# Altium schematic sheet 01_USB.SchDoc: =GlobalProjectName
size 594 x 420 mm; CheckedBy: A_D; Author: A_D; SheetNumber: 1; SheetTotal: 3; PageSetup: Record=PageOptions|CenterHorizontal=True|CenterVertical=True|PrintScale=0.70|XCorrection=1.00|YCorrection=1.00|PrintKind=2|BorderSize=5000000|LeftOffset=9000|BottomOffset=10100|Orientation=2|PaperLength=11176|PaperWidth=8636|Scale=100|PaperSource=259|PrintQuality=-3|MediaType=1|DitherType=10|PrintScaleMode=1|PaperKind=A3|PaperIndex=8
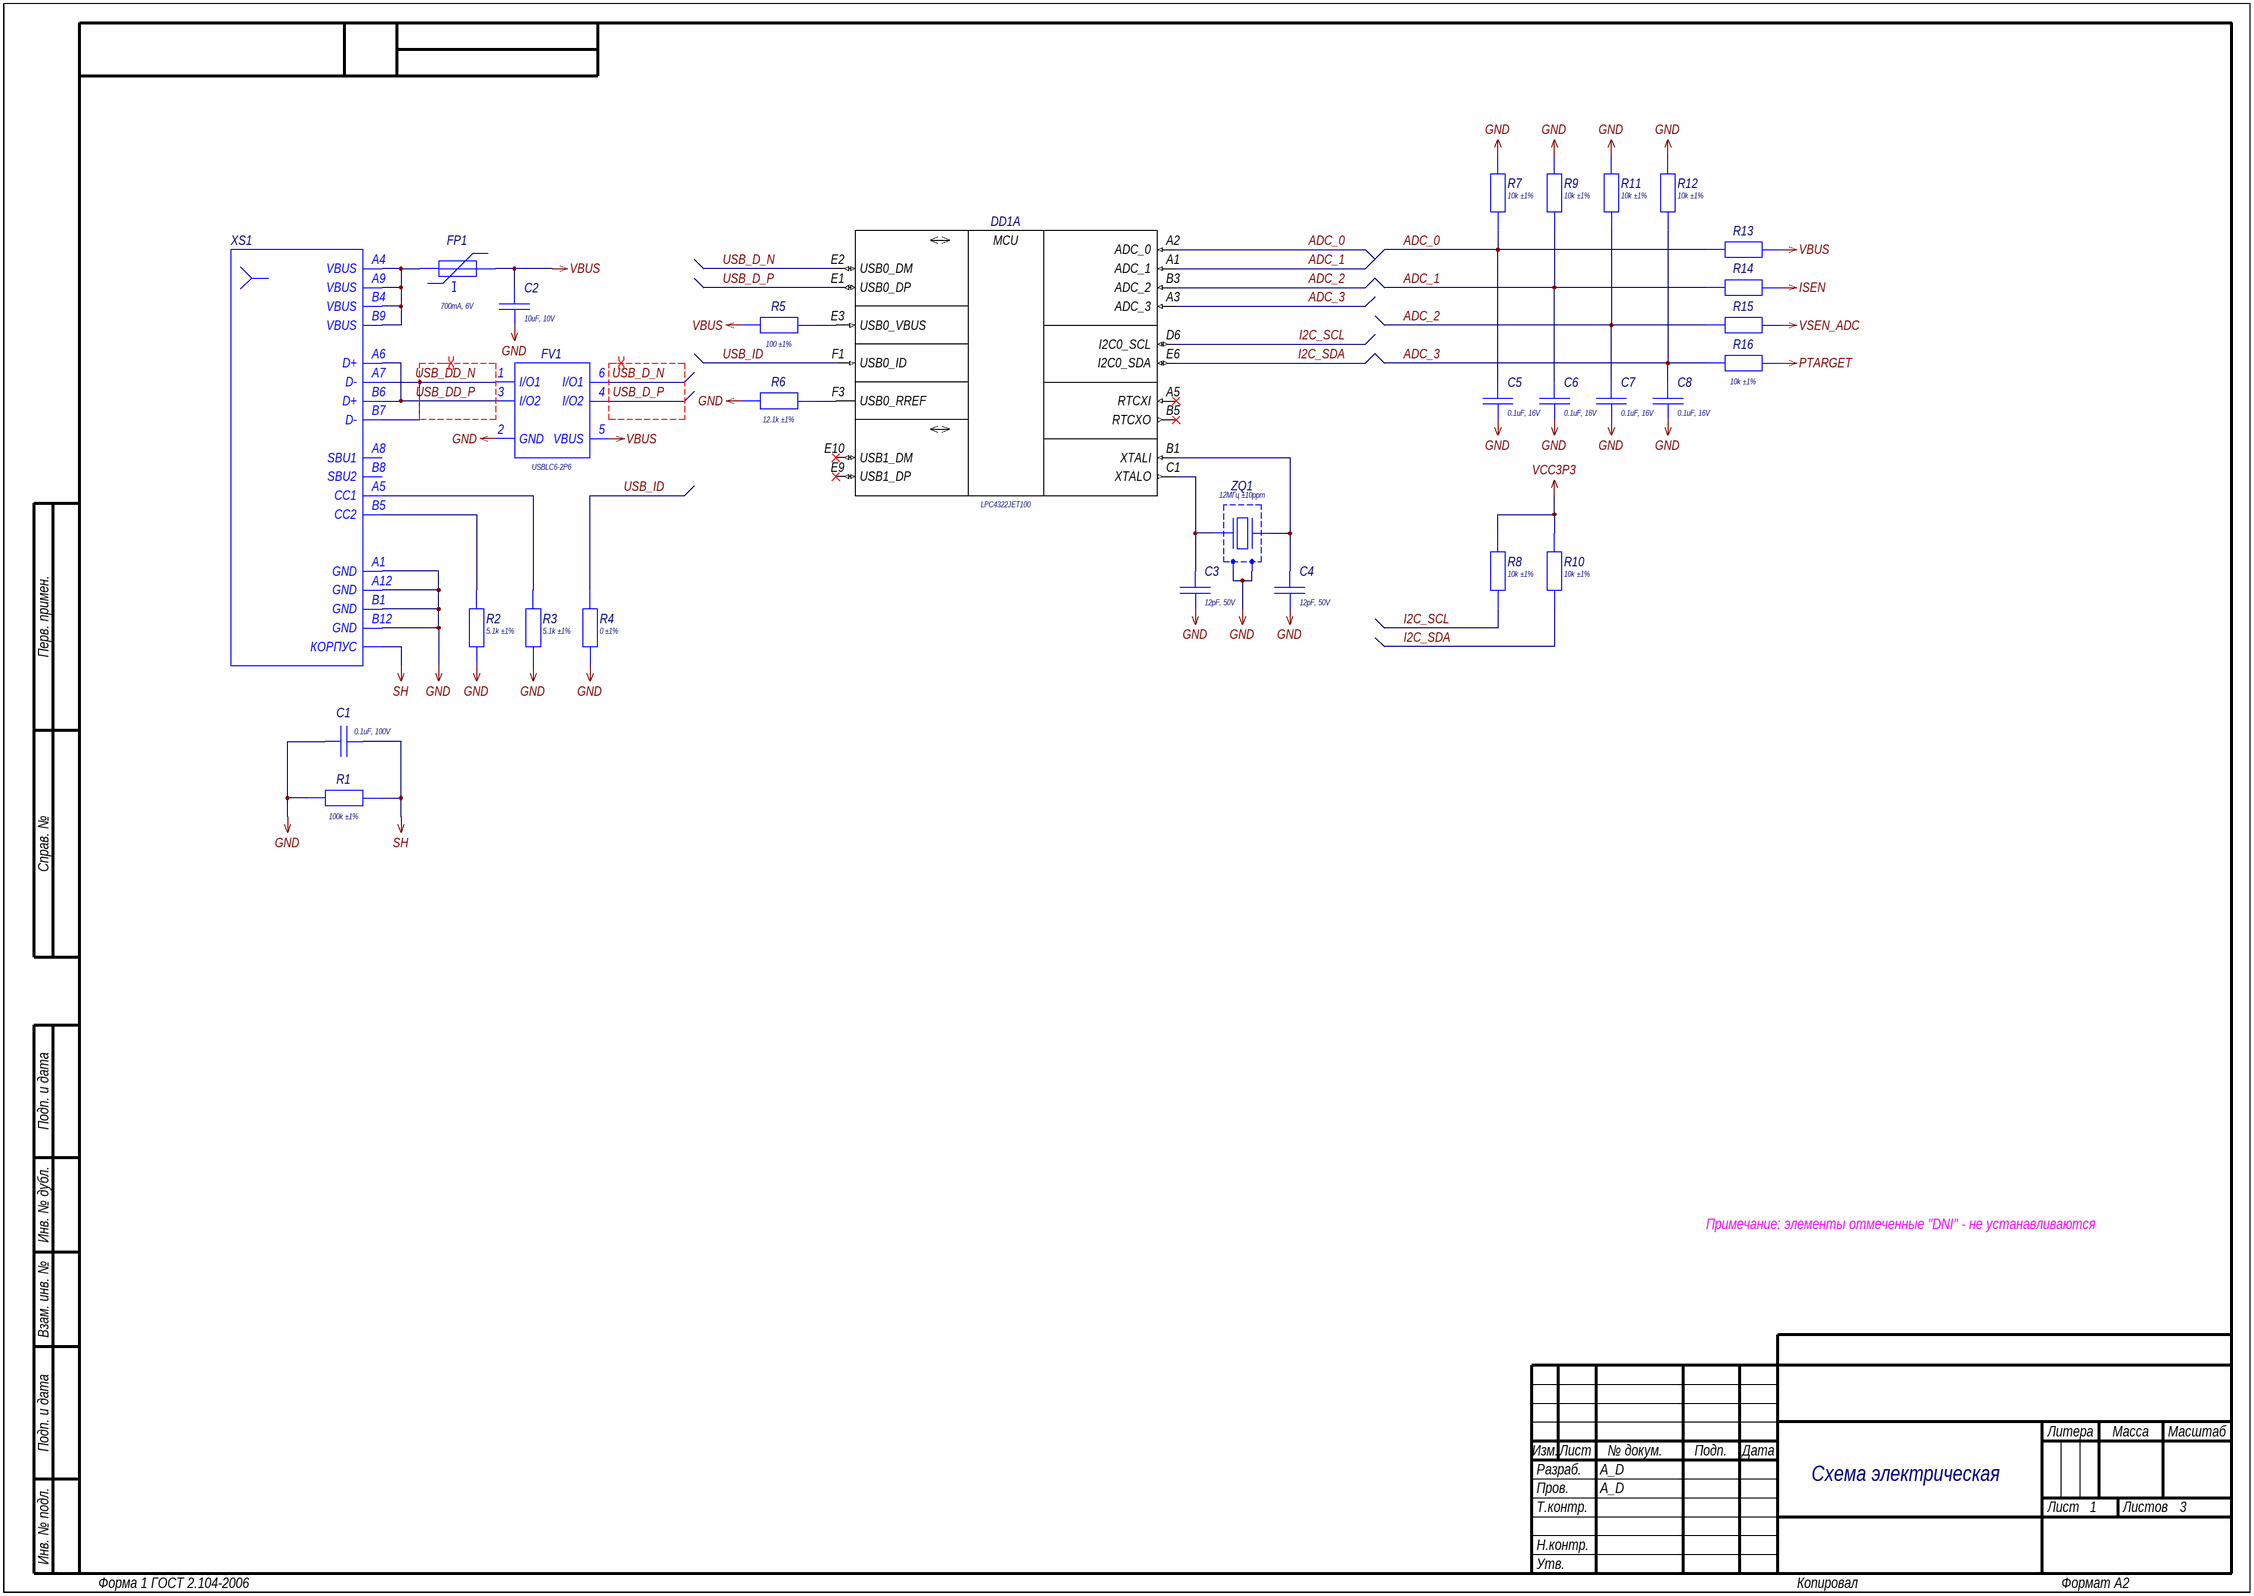
[diagram p0: 01_USB.SchDoc]

## Parts
C1  Schematic Value: 0.1uF, 100V  [C0603_160X080H080_H]  (hidden comment: Capacitor)
C2  Schematic Value: 10uF, 10V  [C0603_160X080H080_H]  (hidden comment: Capacitor)
C3  Schematic Value: 12pF, 50V  [C0402_100X050H050_H]  (hidden comment: Capacitor)
C4  Schematic Value: 12pF, 50V  [C0402_100X050H050_H]  (hidden comment: Capacitor)
C5  Schematic Value: 0.1uF, 16V  [C0402_100X050H050_H]  (hidden comment: Capacitor)
C6  Schematic Value: 0.1uF, 16V  [C0402_100X050H050_H]  (hidden comment: Capacitor)
C7  Schematic Value: 0.1uF, 16V  [C0402_100X050H050_H]  (hidden comment: Capacitor)
C8  Schematic Value: 0.1uF, 16V  [C0402_100X050H050_H]  (hidden comment: Capacitor)
DD1  Schematic Value: LPC4322JET100  [TFBGA-100_080P900X900X120_N]  (hidden comment: LPC43xxJET100-Series)  (part A of 3)
FP1  Schematic Value: 700mA, 6V  [F0402_115X065H060_H]  (hidden comment: Fuse_PTC)
FV1  Schematic Value: USBLC6-2P6  [SOT-666_050P160X120X060_N]  (hidden comment: USBLC6-2x6)
R1  Schematic Value: 100k ±1%  [R0402_100X050H035_H]  (hidden comment: Resistor)
R2  Schematic Value: 5.1k ±1%  [R0402_100X050H035_H]  (hidden comment: Resistor)
R3  Schematic Value: 5.1k ±1%  [R0402_100X050H035_H]  (hidden comment: Resistor)
R4  Schematic Value: 0 ±1%  [R0402_100X050H035_H]  (hidden comment: Resistor)
R5  Schematic Value: 100 ±1%  [R0402_100X050H035_H]  (hidden comment: Resistor)
R6  Schematic Value: 12.1k ±1%  [R0402_100X050H035_H]  (hidden comment: Resistor)
R7  Schematic Value: 10k ±1%  [R0402_100X050H035_H]  (hidden comment: Resistor)
R8  Schematic Value: 10k ±1%  [R0402_100X050H035_H]  (hidden comment: Resistor)
R9  Schematic Value: 10k ±1%  [R0402_100X050H035_H]  (hidden comment: Resistor)
R10  Schematic Value: 10k ±1%  [R0402_100X050H035_H]  (hidden comment: Resistor)
R11  Schematic Value: 10k ±1%  [R0402_100X050H035_H]  (hidden comment: Resistor)
R12  Schematic Value: 10k ±1%  [R0402_100X050H035_H]  (hidden comment: Resistor)
R13  Resistor  [R0402_100X050H035_H]  (value not drawn)
R14  Resistor  [R0402_100X050H035_H]  (value not drawn)
R15  Resistor  [R0402_100X050H035_H]  (value not drawn)
R16  Schematic Value: 10k ±1%  [R0402_100X050H035_H]  (hidden comment: Resistor)
XS1  Text  [U262-161N-4BVC11]  (value not drawn)
ZQ1  Schematic Value: 12МГц ±10ppm  [SMD 3.2x2.5mm]  (hidden comment: Crystal-1_3p_S)

## Nets
GND: C1.2 C2.1 C3.1 C4.1 C5.1 C6.1 C7.1 C8.1 FV1.2(GND) R1.2 R2.1 R3.1 R4.1 R6.1 R7.1 R9.1 R11.1 R12.1 XS1.A1(GND) XS1.A12(GND) XS1.B1(GND) XS1.B12(GND) ZQ1.2 ZQ1.4
ISEN: R14.1
PTARGET: R16.1
SH: C1.1 R1.1 XS1.SH(КОРПУС)
VBUS: C2.2 FP1.2 FV1.5(VBUS) R5.1 R13.1
VCC3P3: R8.1 R10.1
VSEN_ADC: R15.1
ADC_0: C5.2 DD1.A2(ADC_0) R7.2 R13.2
ADC_1: C6.2 DD1.A1(ADC_1) R9.2 R14.2
ADC_2: C7.2 DD1.B3(ADC_2) R11.2 R15.2
ADC_3: C8.2 DD1.A3(ADC_3) R12.2 R16.2
I2C_SCL: DD1.D6(I2C0_SCL) R8.2
I2C_SDA: DD1.E6(I2C0_SDA) R10.2
USB_D_N: DD1.E2(USB0_DM) FV1.6(I/O1)
USB_D_P: DD1.E1(USB0_DP) FV1.4(I/O2)
USB_DD_N: FV1.1(I/O1) XS1.A7(D-) XS1.B7(D-)
USB_DD_P: FV1.3(I/O2) XS1.A6(D+) XS1.B6(D+)
USB_ID: DD1.F1(USB0_ID) R4.2
NetC3_2: C3.2 DD1.C1(XTALO) ZQ1.1
NetC4_2: C4.2 DD1.B1(XTALI) ZQ1.3
NetDD1_E3: DD1.E3(USB0_VBUS) R5.2
NetDD1_F3: DD1.F3(USB0_RREF) R6.2
NetFP1_1: FP1.1 XS1.A4(VBUS) XS1.A9(VBUS) XS1.B4(VBUS) XS1.B9(VBUS)
NetR2_2: R2.2 XS1.B5(CC2)
NetR3_2: R3.2 XS1.A5(CC1)

Not connected (* = marked no-connect by the designer): DD1 A5(RTCXI)* B5(RTCXO)* E9(USB1_DP)* E10(USB1_DM)*; XS1 A8(SBU1) B8(SBU2)

## Layout directives
differential pair: USB_D_N, USB_D_P, USB_DD_N, USB_DD_P

## Notes on the sheet
- Примечание: элементы отмеченные "DNI" - не устанавливаются
- Схема электрическая
  принципиальная
- Перв. примен.
- Справ. №
- Подп. и дата
- Инв. № дубл.
- Взам. инв. №
- Разраб.
- Изм.
- Лист
- № докум.
- Подп.
- Дата
- Литера
- Масса
- Масштаб
- Пров.
- Т.контр.
- Листов
- Инв. № подл.
- Н.контр.
- Утв.
- Форма 1 ГОСТ 2.104-2006
- Копировал
- Формат А2
- (in symbol LPC4322JET100, part A) MCU

## Library data of the parts
C1 = GRM188R72A104KA35D: Manufacturer: Murata; ID: 232; Value: 0.1uF; Voltage: 100V; Tolerance: ±10%; Dielectric Type: X7R; Functional Analog: GRM188R72A104KA35J; AEC Standard: General; Part Number: GRM188R72A104KA35D; Footprint: 0603; LCSC Part: C113803; Temperature Min: -55°С; Temperature Max: +125°С; Part Type: Конденсатор; ClassName: DC
C2 = GRM188R61A106KE69D: Manufacturer: Murata; ID: 173; Value: 10uF; Voltage: 10V; Tolerance: ±10%; Dielectric Type: X5R; Functional Analog: GRM188R61A106KE69J; AEC Standard: General; Part Number: GRM188R61A106KE69D; Footprint: 0603; LCSC Part: C77044; Temperature Min: -55°С; Temperature Max: +85°С; Part Type: Конденсатор; ClassName: DC
C3 C4 = GRM1555C1H120JA01D: Manufacturer: Murata; ID: 159; Value: 12pF; Voltage: 50V; Tolerance: ±5%; Dielectric Type: NP0; Functional Analog: GJM1555C1H120GB01D, GRM1555C1H120JA01J, GRM1555C1H120JA01W; AEC Standard: General; Part Number: GRM1555C1H120JA01D; Footprint: 0402; LCSC Part: C76948; Temperature Min: -55°С; Temperature Max: +125°С; Part Type: Конденсатор
C5-C8 = GCM155R71C104KA55D: Manufacturer: Murata; ID: 163; Value: 0.1uF; Voltage: 16V; Tolerance: ±10%; Dielectric Type: X7R; Functional Analog: GRM155R71C104KA88D, GCM155R71C104KA55J, GCM155R71C104KA55W; AEC Standard: AEC-Q200; Part Number: GCM155R71C104KA55D; Footprint: 0402; LCSC Part: C85857; Temperature Min: -55°С; Temperature Max: +125°С; Part Type: Конденсатор
DD1 = LPC4322JET100: Manufacturer: NXP Semiconductors; ID: 45; Supply Operation: +2.4…3.6V; Prog Interface: JTAG, SWD, USB; Operation Frequency: 204MHz; ROM: 512K; RAM: 104K; IO Lines: 49; Part Number: LPC4322JET100; Value: LPC4322JET100; Temperature Min: -40°С; Temperature Max: +105°С
FP1 = 0402L035SLKR: Manufacturer: Littelfuse; ID: 17; Limit Voltage: 6V; Hold Current: 350mA; Resistance: 0.7ohm; Trip Current: 700mA; Current Rating Max: 50A; Part Number: 0402L035SLKR; Value: 0402L035SLKR; Temperature Min: -40°С; Temperature Max: +85°С; Part Type: Предохранитель; ClassName: DC
FV1 = USBLC6-2P6: Manufacturer: STMicroelectronics; ID: 30; Breakdown Voltage: 6V; Reverse Stand Off Voltage: 17V; Forward Voltage: 0.95V; Peak Forward Current: 5A; Junction Capacitance: 2.5pF; Directional: Bidirectional; Functional Analog: TPUSBLC6-2P6; Part Number: USBLC6-2P6; Value: USBLC6-2P6; LCSC Part: C15999; Temperature Min: -40°С; Temperature Max: +125°С
R1 = 0402WGF1003TCE: Manufacturer: Uniroyal Elec; ID: 661; Value: 100k; Limit Voltage: 50V; Tolerance: ±1%; Temperature Coefficient: 100ppm; Total Power Dissipation: 0.1W; Series Type: Thick-Film; Part Number: 0402WGF1003TCE; Footprint: 0402; Temperature Min: -55°С; Temperature Max: +155°С; Part Type: Резистор; LCSC Part: C25741; ClassName: DC
R2 R3 = 0402WGF5101TCE: Manufacturer: Uniroyal Elec; ID: 667; Value: 5.1k; Limit Voltage: 50V; Tolerance: ±1%; Temperature Coefficient: 100ppm; Total Power Dissipation: 0.1W; Series Type: Thick-Film; Part Number: 0402WGF5101TCE; Footprint: 0402; Temperature Min: -55°С; Temperature Max: +155°С; Part Type: Резистор; LCSC Part: C25905
R4 = 0402WGF0000TCE: Manufacturer: Uniroyal Elec; ID: 666; Value: 0; Limit Voltage: 50V; Tolerance: ±1%; Temperature Coefficient: 800ppm; Total Power Dissipation: 0.1W; Series Type: Thick-Film; Part Number: 0402WGF0000TCE; Footprint: 0402; Temperature Min: -55°С; Temperature Max: +155°С; Part Type: Резистор; LCSC Part: C17168
R5 = RC0402FR-07100RL: Manufacturer: Yageo; ID: 457; Value: 100; Limit Voltage: 50V; Tolerance: ±1%; Temperature Coefficient: 100ppm; Total Power Dissipation: 0.1W; Series Type: Thick-Film; Part Number: RC0402FR-07100RL; Footprint: 0402; Temperature Min: -55°С; Temperature Max: +155°С; Part Type: Резистор
R6 = RC0402FR-0712K1L: Manufacturer: Yageo; ID: 484; Value: 12.1k; Limit Voltage: 50V; Tolerance: ±1%; Temperature Coefficient: 100ppm; Total Power Dissipation: 0.1W; Series Type: Thick-Film; Part Number: RC0402FR-0712K1L; Footprint: 0402; Temperature Min: -55°С; Temperature Max: +155°С; Part Type: Резистор
R7-R12 R16 = 0402WGF1002TCE: Manufacturer: Uniroyal Elec; ID: 665; Value: 10k; Limit Voltage: 50V; Tolerance: ±1%; Temperature Coefficient: 100ppm; Total Power Dissipation: 0.1W; Series Type: Thick-Film; Part Number: 0402WGF1002TCE; Footprint: 0402; Temperature Min: -55°С; Temperature Max: +155°С; Part Type: Резистор; LCSC Part: C25744
R13-R15 = 0402WGF1002TCE: Manufacturer: Uniroyal Elec; ID: 665; Value: 10k; Limit Voltage: 50V; Tolerance: ±1%; Temperature Coefficient: 100ppm; Total Power Dissipation: 0.1W; Series Type: Thick-Film; Schematic Value: 10k ±1%; Part Number: 0402WGF1002TCE; Footprint: 0402; Temperature Min: -55°С; Temperature Max: +155°С; Part Type: Резистор; LCSC Part: C25744
XS1 = U262-161N-4BVC11: Manufacturer: XKB Enterprise; ID: 41; Limit Voltage: 30V; Limit Current: 3A; Connector Type: Female; Interface: USB 3.1 Type C; Max Data Rate: 5 Gbps; Part Number: U262-161N-4BVC11; Value: U262-161N-4BVC11; Pins: 16; Mount Type: Surface; LCSC Part: C319148; Temperature Min: -40°С; Temperature Max: +85°С; Schematic Value: U262-161N-4BVC11; Part Type: Розетка; ClassName: DC
ZQ1 = X322512MOB4SI: Manufacturer: Yangxing Tech; ID: 44; Output Frequency: 12МГц; Shunt Capacitance: 7pF; Load Capacitance: 12pF; Temperature Coefficient: ±10ppm; Part Number: X322512MOB4SI; Value: X322512MOB4SI; LCSC Part: C70565; Temperature Min: -40°С; Temperature Max: +85°С; Part Type: Кварцевый резонатор